# EAGLE design minimumSystem (tugas nanang) (EAGLE 7.5.0)
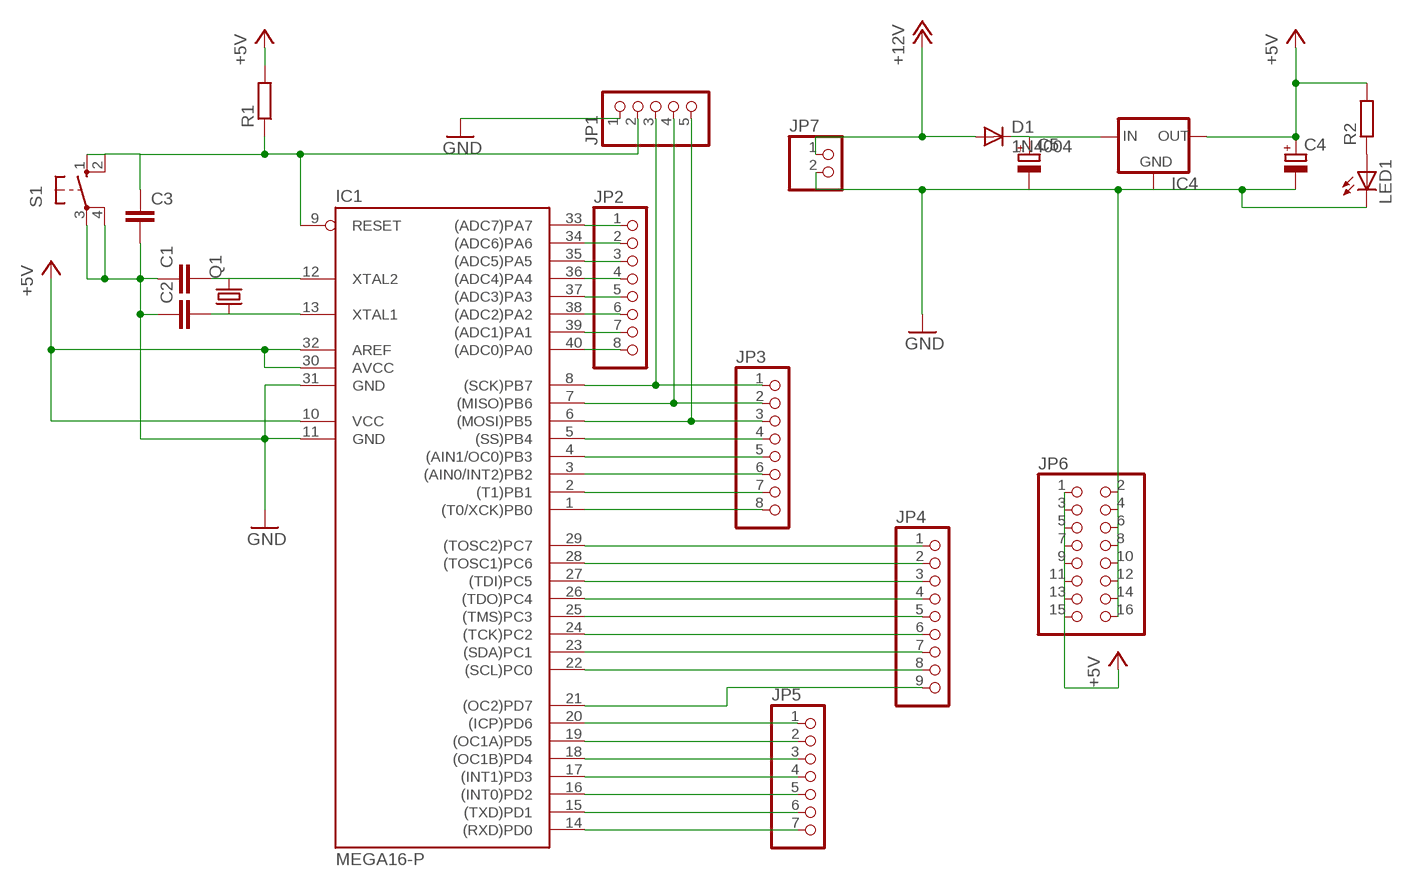
[diagram p0: schematic, sheet 1]

## Parts
C1  C-EU025-024X044  [C025-024X044]
C2  C-EU025-024X044  [C025-024X044]
C3  C-EU050-025X075  [C050-025X075]
C4  CPOL-EUE2.5-5  [E2,5-5]
C5  CPOL-EUE2.5-5  [E2,5-5]
D1  1N4004  [DO41-10]
IC1  MEGA16-P  [DIL40]
IC4  78XXS  [78XXS]
JP1  PINHD-1X5  [1X05]
JP2  PINHD-1X8  [1X08]
JP3  PINHD-1X8  [1X08]
JP4  PINHD-1X9  [1X09]
JP5  PINHD-1X7  [1X07]
JP6  PINHD-2X8  [2X08]
JP7  PINHD-1X2  [1X02]
LED1  LED5MM  [LED5MM]
Q1  CRYSTALHC49U-V  [HC49U-V]
R1  R-EU_0204/7  [0204/7]
R2  R-EU_0204/7  [0204/7]
S1  10-XX  [B3F-10XX]

## Nets
+5V: C4.+ IC1.10(VCC) IC1.30(AVCC) IC1.32(AREF) IC4.OUT JP6.1 JP6.3 JP6.5 JP6.7 JP6.9 JP6.11 JP6.13 JP6.15 R1.2 R2.2
+12V: D1.A JP7.1
C0: IC1.22((SCL)PC0) JP4.8
C1: IC1.23((SDA)PC1) JP4.7
C2: IC1.24((TCK)PC2) JP4.6
C3: IC1.25((TMS)PC3) JP4.5
D7: IC1.14((RXD)PD0) JP5.7
GND: C1.1 C2.1 C3.2 C4.- C5.- IC1.11(GND) IC1.31(GND) IC4.GND JP1.1 JP6.2 JP6.4 JP6.6 JP6.8 JP6.10 JP6.12 JP6.14 JP6.16 JP7.2 LED1.K(C) S1.3(P) S1.4(P1)
N$1: IC1.33((ADC7)PA7) JP2.1
N$2: IC1.34((ADC6)PA6) JP2.2
N$3: IC1.35((ADC5)PA5) JP2.3
N$4: IC1.36((ADC4)PA4) JP2.4
N$5: IC1.37((ADC3)PA3) JP2.5
N$6: IC1.38((ADC2)PA2) JP2.6
N$7: IC1.39((ADC1)PA1) JP2.7
N$8: IC1.40((ADC0)PA0) JP2.8
N$11: IC1.29((TOSC2)PC7) JP4.1
N$12: IC1.28((TOSC1)PC6) JP4.2
N$13: IC1.27((TDI)PC5) JP4.3
N$14: IC1.5((SS)PB4) JP3.4
N$15: IC1.20((ICP)PD6) JP5.1
N$16: IC1.19((OC1A)PD5) JP5.2
N$19: IC1.26((TDO)PC4) JP4.4
N$20: IC1.6((MOSI)PB5) JP1.5 JP3.3
N$21: IC1.4((AIN1/OC0)PB3) JP3.5
N$22: IC1.3((AIN0/INT2)PB2) JP3.6
N$23: IC1.2((T1)PB1) JP3.7
N$24: IC1.1((T0/XCK)PB0) JP3.8
N$25: C5.+ D1.C IC4.IN
N$30: IC1.15((TXD)PD1) JP5.6
N$31: IC1.16((INT0)PD2) JP5.5
N$32: IC1.17((INT1)PD3) JP5.4
N$33: C3.1 IC1.9(RESET) JP1.2 R1.1 S1.1(S) S1.2(S1)
N$34: IC1.18((OC1B)PD4) JP5.3
N$35: C1.2 IC1.12(XTAL2) Q1.2
N$36: C2.2 IC1.13(XTAL1) Q1.1
N$37: LED1.A R2.1
N$46: IC1.8((SCK)PB7) JP1.3 JP3.1
N$47: IC1.7((MISO)PB6) JP1.4 JP3.2
RS: IC1.21((OC2)PD7) JP4.9

## Library data of the parts
C1 C2 = rcl:C-EU: CAPACITOR, European symbol
C3 = resistor:C-EU: CAPACITOR, European symbol
C4 C5 = rcl:CPOL-EU: POLARIZED CAPACITOR, European symbol
D1 = diode:1N4004: DIODE general purpose rectifier, 1 A
IC1 = atmel:MEGA16-P: MICROCONTROLLER 16 Kbytes FLASH 1 kbytes SRAM 512 bytes EEPROM USART 8-channel 10 bit ADC Source: avr.lbr; MPN: ATMEGA16-16PU; OC_FARNELL: 9171142; OC_NEWARK: 01M6885
IC4 = v-reg:78XXS: VOLTAGE REGULATOR
JP1 = pinhead:PINHD-1X5: PIN HEADER
JP2 JP3 = pinhead:PINHD-1X8: PIN HEADER
JP4 = pinhead:PINHD-1X9: PIN HEADER
JP5 = pinhead:PINHD-1X7: PIN HEADER
JP6 = pinhead:PINHD-2X8: PIN HEADER
JP7 = pinhead:PINHD-1X2: PIN HEADER
LED1 = led:LED: LED OSRAM: - CHIPLED LG R971, LG N971, LY N971, LG Q971, LY Q971, LO R971, LY R971 LH N974, LH R974 LS Q976, LO Q976, LY Q976 LO Q996 - Hyper CHIPLED LW Q18S LB Q993, LB Q99A, LB R99A - SideLED LS A670, LO A670, LY A670, LG A670, LP A670 LB A673, LV A673, LT A673, LW A673 LH A674 LY A675 LS A676, LA A676, LO A676, LY A676, LW A676 LS A679, LY A679, LG A679 - Hyper Micro SIDELED® LS Y876, LA Y876, LO Y876, LY Y876 LT Y87S - SmartLED LW L88C, LW L88S LB L89C, LB L89S, LG L890 LS L89K, LO L89K, LY L89K LS L896, LA L896, LO L896, LY L896 - TOPLED LS T670, LO T670, LY T670, LG T670, LP T670 LSG T670, LSP T670, LSY T670, LOP T670, LYG T670 LG T671, LOG T671, LSG T671 LB T673, LV T673, LT T673, LW T673 LH T674 LS T676, LA T676, LO T676, LY T676, LB T676, LH T676, LSB T676, LW T676 LB T67C, LV T67C, LT T67C, LS T67K, LO T67K, LY T67K, LW E67C LS E67B, LA E67B, LO E67B, LY E67B, LB E67C, LV E67C, LT E67C LW T67C LS T679, LY T679, LG T679 LS T770, LO T770, LY T770, LG T770, LP T770 LB T773, LV T773, LT T773, LW T773 LH T774 LS E675, LA E675, LY E675, LS T675 LS T776, LA T776, LO T776, LY T776, LB T776 LHGB T686 LT T68C, LB T68C - Hyper Mini TOPLED® LB M676 - Mini TOPLED Santana® LG M470 LS M47K, LO M47K, LY M47K Source: http://www.osram.convergy.de LUXEON: - LUMILED® LXK2-PW12-R00, LXK2-PW12-S00, LXK2-PW14-U00, LXK2-PW14-V00 LXK2-PM12-R00, LXK2-PM12-S00, LXK2-PM14-U00 LXK2-PE12-Q00, LXK2-PE12-R00, LXK2-PE12-S00, LXK2-PE14-T00, LXK2-PE14-U00 LXK2-PB12-K00, LXK2-PB12-L00, LXK2-PB12-M00, LXK2-PB14-N00, LXK2-PB14-P00, LXK2-PB14-Q00 LXK2-PR12-L00, LXK2-PR12-M00, LXK2-PR14-Q00, LXK2-PR14-R00 LXK2-PD12-Q00, LXK2-PD12-R00, LXK2-PD12-S00 LXK2-PH12-R00, LXK2-PH12-S00 LXK2-PL12-P00, LXK2-PL12-Q00, LXK2-PL12-R00 Source: www.luxeon.com KINGBRIGHT: KA-3528ASYC Source: www.kingbright.com
Q1 = crystal:CRYSTAL: CRYSTAL; OC_FARNELL: 1666969; OC_NEWARK: unknown
R1 R2 = rcl:R-EU_: RESISTOR, European symbol
S1 = switch-omron:10-XX: OMRON SWITCH; MPN: B3F-1000; OC_FARNELL: 176432; OC_NEWARK: 36M3542

## Board
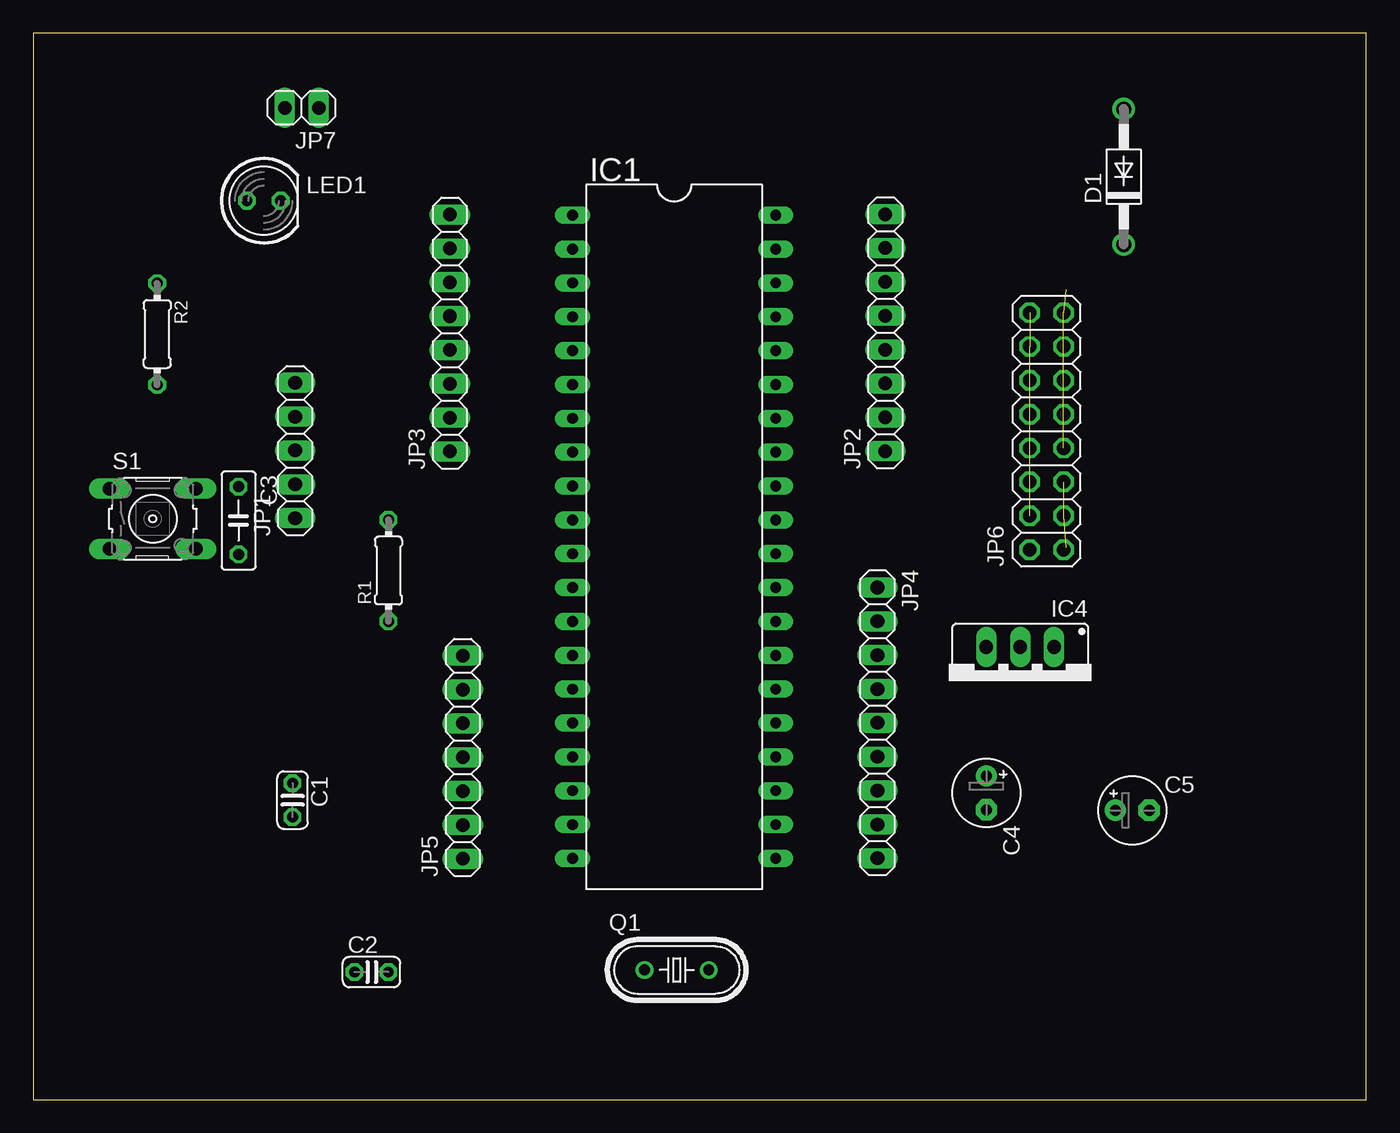
[diagram p1: board, top side]
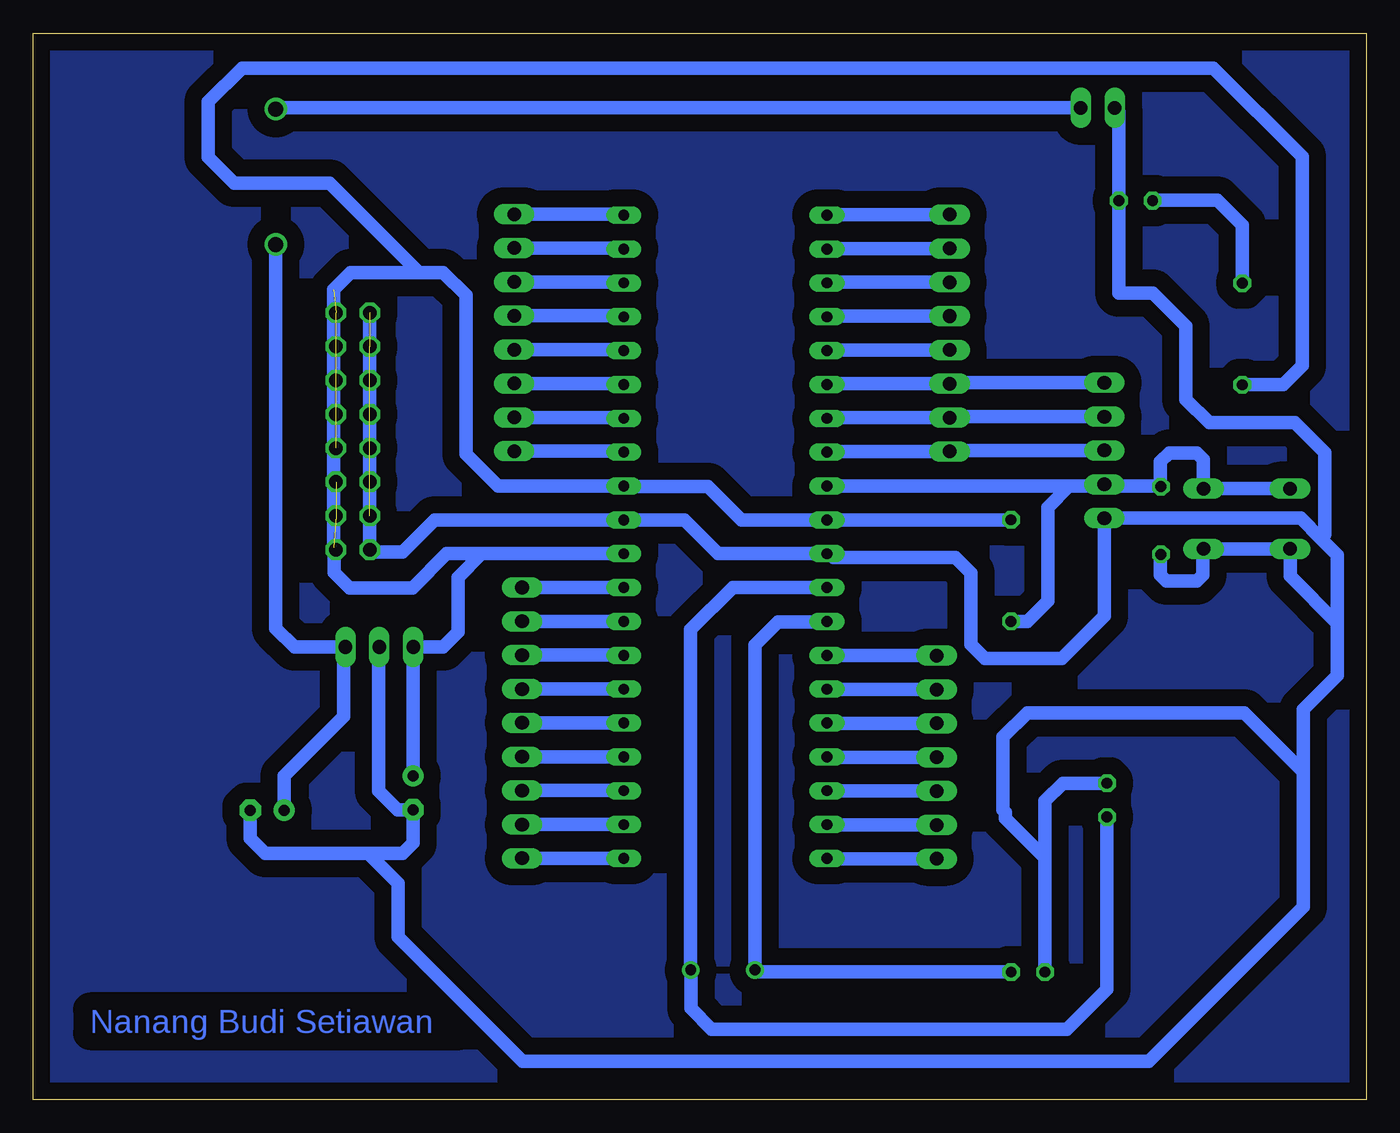
[diagram p2: board, bottom side, seen from below]

Size 100 x 80 mm. Coordinates in mm from the lower left corner, seen from the top.
Outline: 0,0 100,0 100,80 0,80 0,0
Copper layers (1*16): Top 0.035mm / dielectric 1.5mm / Bottom 0.035mm
Design rules "default": minimum track width 10mil, minimum drill 24mil, track to track 8mil, track to pad 8mil, pad to pad 8mil, via to via 8mil, smd to smd 8mil, copper to edge 40mil, drill to drill 8mil, minimum pad ring 10mil, minimum via ring 8mil, stop-mask expansion 4mil, vias tented up to drill 0mil, thermal gap 10mil

### Footprints (pad centres in the part's own frame; a part is rotated, then mirrored left to right if it is on the bottom)
C025-024X044 = drill 0.813 octagon: 1 -1.27,0; 2 1.27,0
C050-025X075 = drill 0.813 octagon: 1 -2.54,0; 2 2.54,0
E2,5-5 = drill 0.813 pad 1.6: + -1.27,0 | drill 0.813 pad 1.6 octagon: - 1.27,0
DO41-10 = drill 1.118: A 5.08,0; C -5.08,0
DIL40 = drill 0.813 long: 1 -24.13,-7.62; 2 -21.59,-7.62; 3 -19.05,-7.62; 4 -16.51,-7.62; 5 -13.97,-7.62; 6 -11.43,-7.62; 7 -8.89,-7.62; 8 -6.35,-7.62; 9 -3.81,-7.62; 10 -1.27,-7.62; 11 1.27,-7.62; 12 3.81,-7.62; 13 6.35,-7.62; 14 8.89,-7.62; 15 11.43,-7.62; 16 13.97,-7.62; 17 16.51,-7.62; 18 19.05,-7.62; 19 21.59,-7.62; 20 24.13,-7.62; 21 24.13,7.62; 22 21.59,7.62; 23 19.05,7.62; 24 16.51,7.62; 25 13.97,7.62; 26 11.43,7.62; 27 8.89,7.62; 28 6.35,7.62; 29 3.81,7.62; 30 1.27,7.62; 31 -1.27,7.62; 32 -3.81,7.62; 33 -6.35,7.62; 34 -8.89,7.62; 35 -11.43,7.62; 36 -13.97,7.62; 37 -16.51,7.62; 38 -19.05,7.62; 39 -21.59,7.62; 40 -24.13,7.62
78XXS = drill 1.016 long: GND 0,-2.54; IN -2.54,-2.54; OUT 2.54,-2.54
1X05 = drill 1.016 long: 1 -5.08,0; 2 -2.54,0; 3 0,0; 4 2.54,0; 5 5.08,0
1X08 = drill 1.016 long: 1 -8.89,0; 2 -6.35,0; 3 -3.81,0; 4 -1.27,0; 5 1.27,0; 6 3.81,0; 7 6.35,0; 8 8.89,0
1X09 = drill 1.016 long: 1 -10.16,0; 2 -7.62,0; 3 -5.08,0; 4 -2.54,0; 5 0,0; 6 2.54,0; 7 5.08,0; 8 7.62,0; 9 10.16,0
1X07 = drill 1.016 long: 1 -7.62,0; 2 -5.08,0; 3 -2.54,0; 4 0,0; 5 2.54,0; 6 5.08,0; 7 7.62,0
2X08 = drill 1.016 octagon: 1 -8.89,-1.27; 2 -8.89,1.27; 3 -6.35,-1.27; 4 -6.35,1.27; 5 -3.81,-1.27; 6 -3.81,1.27; 7 -1.27,-1.27; 8 -1.27,1.27; 9 1.27,-1.27; 10 1.27,1.27; 11 3.81,-1.27; 12 3.81,1.27; 13 6.35,-1.27; 14 6.35,1.27; 15 8.89,-1.27; 16 8.89,1.27
1X02 = drill 1.016 long: 1 -1.27,0; 2 1.27,0
LED5MM = drill 0.813 octagon: A -1.27,0; K 1.27,0
HC49U-V = drill 0.813: 1 -2.413,0; 2 2.413,0
0204/7 = drill 0.813 octagon: 1 -3.81,0; 2 3.81,0
B3F-10XX = drill 1.016 long: 1 -3.251,2.261; 2 3.251,2.261; 3 -3.251,-2.261; 4 3.251,-2.261

### Placement (x,y rotation side)
C1  19.45,22.47 270 top
C2  25.37,9.57 0 top
C3  15.4,43.44 270 top
C4  71.5,23.01 270 top
C5  82.45,21.7 0 top
D1  81.81,69.24 90 top
IC1  48.08,42.22 270 top
IC4  74.04,31.42 180 top
JP1  19.64,48.7 90 top
JP2  63.92,57.54 90 top
JP3  31.25,57.51 90 top
JP4  63.33,28.26 270 top
JP5  32.22,25.68 90 top
JP6  76.02,50.15 90 top
JP7  20.14,74.41 180 top
LED1  17.29,67.44 0 top
Q1  48.27,9.72 0 top
R1  26.65,39.69 90 top
R2  9.29,57.44 270 top
S1  8.96,43.57 0 top

### Tracks (layer width: path | path; a pad name or v marks a point on that pad's centre or on a via)
+5V  (7 unrouted)
  Bottom 1.016: 71.06,62.06 69.25,62.06 67.54,60.35 67.54,48.45 65.13,46.03 IC1.32 55.65,45.98 49.37,45.98 46.88,43.49 IC1.10 R1.2 | 71.06,62.06 76.18,62.06 77.46,60.77 77.46,41.43 JP6.1 77.42,41.13 77.42,39.54 76.28,38.4 71.56,38.4 69,40.95 66.35,40.95 | IC1.30 66.35,40.95 | 66.35,40.95 68.13,39.17 68.13,35.1 69.27,33.96 IC4.OUT C4.+ | R2.2 6.23,53.63 4.8,55.05 4.8,70.75 11.45,77.4 84.34,77.4 86.87,74.86 86.87,70.7 84.94,68.77 77.77,68.77 71.06,62.06
+12V
  Bottom 1.016: JP7.1 81.71,74.42 D1.A
C0
  Bottom 1.016: JP4.8 IC1.22
C1
  Bottom 1.016: JP4.7 IC1.23
C2
  Bottom 1.016: JP4.6 IC1.24
C3
  Bottom 1.016: IC1.25 JP4.5
D7
  Bottom 1.016: JP5.7 40.43,33.3 IC1.14
GND  (6 unrouted)
  Bottom 1.016: JP6.16 JP6.2 74.58,41.09 72.29,41.09 69.88,43.49 IC1.31 51.15,43.49 48.61,40.95 IC1.11 40.25,40.95 39.96,40.66 30.82,40.66 29.67,39.51 29.67,34.14 28.61,33.08 22.84,33.08 19.63,36.29 19.63,43.6 JP1.1 | 19.69,43.66 JP1.1 | 74.9,18.46 72.3,18.46 71.5,19.26 C4.- 72.66,21.74 74.09,23.17 74.09,33.91 IC4.GND | 74.9,18.46 82.61,18.46 83.74,19.6 83.74,21.68 C5.- | JP7.2 18.56,74.11 LED1.K 18.56,60.52 16.01,60.52 13.51,58.03 13.51,52.53 11.78,50.79 5.35,50.79 3.11,48.55 3.11,42.4 3.4,42.11 | C1.1 19.46,23.73 22.76,23.73 24.1,22.39 C2.1 24.1,18.14 27.07,21.11 27.07,21.54 27.25,21.72 27.25,27.19 25.42,29.01 9.15,29.01 4.72,24.58 | 4.72,24.58 4.72,29.27 2.15,31.83 2.15,35.72 | 4.72,24.58 4.72,14.47 16.31,2.88 63.3,2.88 72.64,12.22 72.64,16.21 74.9,18.46 | JP1.1 4.9,43.62 3.4,42.11 | 3.4,42.11 2.15,40.87 2.15,35.72 | S1.4 S1.3 5.71,39.27 2.15,35.72 | 12.2,41.3 S1.4 | C3.2 15.4,40.87 15.46,40.81 15.46,39.36 15,38.9 12.7,38.9 12.24,39.36 12.24,41.28 S1.4
N$1
  Bottom 1.016: JP2.1 55.78,48.65 IC1.33
N$2
  Bottom 1.016: JP2.2 55.78,51.19 IC1.34
N$3
  Bottom 1.016: JP2.3 55.78,53.73 IC1.35
N$4
  Bottom 1.016: JP2.4 55.78,56.27 IC1.36
N$5
  Bottom 1.016: JP2.5 55.78,58.81 IC1.37
N$6
  Bottom 1.016: JP2.6 55.78,61.35 IC1.38
N$7
  Bottom 1.016: JP2.7 55.78,63.89 IC1.39
N$8
  Bottom 1.016: JP2.8 55.78,66.43 IC1.40
N$9
  pour Bottom (isolate 1.27): 99.63,80.17 99.63,0.15 0.09,0.15 -0.06,79.87
N$11
  Bottom 1.016: IC1.29 JP4.1
N$12
  Bottom 1.016: JP4.2 IC1.28
N$13
  Bottom 1.016: JP4.3 IC1.27
N$14
  Bottom 1.016: JP3.4 40.41,56.24 IC1.5
N$15
  Bottom 1.016: JP5.1 40.43,18.06 IC1.20
N$16
  Bottom 1.016: JP5.2 40.43,20.6 IC1.19
N$19
  Bottom 1.016: JP4.4 IC1.26
N$20
  Bottom 1.016: IC1.6 40.41,53.7 JP3.3 31.18,53.78 JP1.5
N$21
  Bottom 1.016: JP3.5 40.41,58.78 IC1.4
N$22
  Bottom 1.016: JP3.6 40.41,61.32 IC1.3
N$23
  Bottom 1.016: JP3.7 40.41,63.86 IC1.2
N$24
  Bottom 1.016: JP3.8 40.41,66.4 IC1.1
N$25
  Bottom 1.016: D1.C 81.81,35.36 80.4,33.95 76.59,33.95 IC4.IN 76.71,33.83 76.71,28.76 81.18,24.29 C5.+
N$30
  Bottom 1.016: JP5.6 40.43,30.76 IC1.15
N$31
  Bottom 1.016: JP5.5 40.43,28.22 IC1.16
N$32
  Bottom 1.016: JP5.4 40.43,25.68 IC1.17
N$33
  Bottom 1.016: IC1.9 22.29,46.03 | 22.29,46.03 19.77,46.03 | 19.77,46.03 JP1.2 | 19.77,46.03 15.45,46.03 C3.1 15.45,46.03 15.45,47.85 14.78,48.52 12.72,48.52 12.21,48.01 S1.2 S1.1 | R1.1 25.42,35.88 23.89,37.4 23.89,44.42 22.29,46.03
N$34
  Bottom 1.016: JP5.3 40.43,23.14 IC1.18
N$35
  Bottom 1.016: IC1.12 47.52,38.42 50.68,35.25 Q1.2 50.67,6.84 49.11,5.28 22.45,5.28 19.45,8.28 C1.2
N$36
  Bottom 1.016: IC1.13 40.5,35.83 44.13,35.83 45.85,34.1 Q1.1 45.7,9.57 C2.2
N$37
  Bottom 1.016: R2.1 9.29,65.62 11.17,67.49 15.97,67.49 LED1.A
N$46
  Bottom 1.016: IC1.8 40.41,48.62 JP3.1 31.18,48.7 JP1.3
N$47
  Bottom 1.016: IC1.7 40.41,51.16 JP3.2 31.18,51.24 JP1.4
RS
  Bottom 1.016: JP4.9 IC1.21

### Text on the board
Bottom: Nanang Budi Setiawan